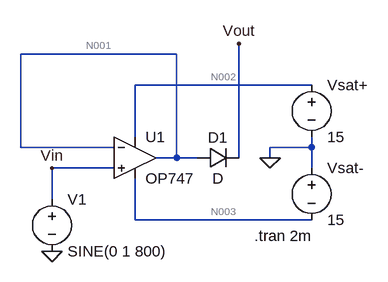
[diagram p0: schematic PRECISION_DIODE.asc]
PRECISION_DIODE.asc, the LTspice schematic file:
Version 4
SHEET 1 880 680
WIRE 448 0 208 0
WIRE 656 48 384 48
WIRE 384 128 384 48
WIRE 208 144 208 0
WIRE 352 144 208 144
WIRE 656 144 656 128
WIRE 656 144 592 144
WIRE 448 160 448 0
WIRE 448 160 416 160
WIRE 480 160 448 160
WIRE 544 160 544 -16
WIRE 592 160 592 144
WIRE 352 176 256 176
WIRE 656 176 656 144
WIRE 256 224 256 176
WIRE 384 256 384 192
WIRE 656 256 384 256
FLAG 592 160 0
FLAG 544 -16 Vout
FLAG 256 304 0
FLAG 256 176 Vin
SYMBOL OpAmps\\OP747 384 96 R0
SYMATTR InstName U1
SYMBOL voltage 656 32 R0
WINDOW 123 0 0 Left 0
WINDOW 39 0 0 Left 0
SYMATTR InstName Vsat+
SYMATTR Value 15
SYMBOL voltage 656 160 R0
WINDOW 123 0 0 Left 0
WINDOW 39 0 0 Left 0
SYMATTR InstName Vsat-
SYMATTR Value 15
SYMBOL voltage 256 208 R0
WINDOW 123 0 0 Left 0
WINDOW 39 0 0 Left 0
SYMATTR InstName V1
SYMATTR Value SINE(0 1 800)
SYMBOL diode 480 176 R270
WINDOW 0 32 32 VTop 2
WINDOW 3 0 32 VBottom 2
SYMATTR InstName D1
TEXT 568 280 Left 2 !.tran 2m

The netlist it stands for:
* PRECISION_DIODE.asc
XU1 Vin N001 N002 N003 N001 OP747  ; pins In+ In- V+ V- OUT
Vsat+ N002 0 15
Vsat- 0 N003 15
V1 Vin 0 SINE(0 1 800)
D1 N001 Vout D
.model D D
.lib standard.dio
.tran 2m
.backanno
.end

* Results of the author's LTspice run, read from the files saved beside the schematic
* Operating Point, zero values left out:
*   V(n001) = 80 µV
*   V(n003) = -15 V
*   V(n002) = 15 V
*   V(vout) = 80 µV
*   I(V1) = 10.86 nA
*   I(Vsat-) = -304.4 µA
*   I(Vsat+) = -304.4 µA
*   Ix(u1:1) = -10.86 nA
*   Ix(u1:2) = -8.856 nA
*   Ix(u1:99) = 304.4 µA
*   Ix(u1:50) = -304.4 µA
*   Ix(u1:45) = 8.856 nA
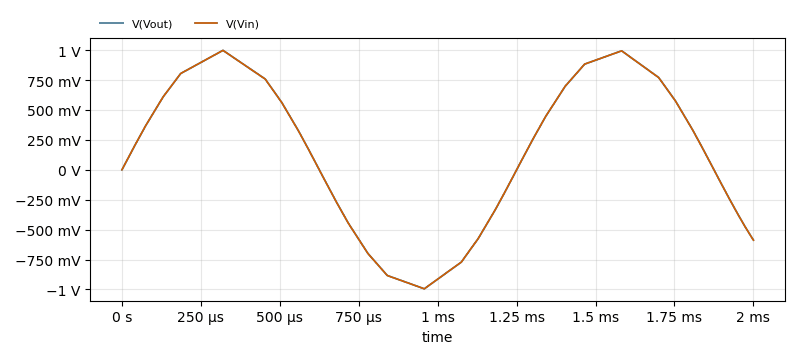
[diagram p1: Transient Analysis of PRECISION_DIODE.asc, plotted from the saved traces]
* Transient Analysis, 1 run:
*   V(Vout): min -994.2 mV, max 998.2 mV, average 174.9 mV, rms 677.9 mV, last -586.8 mV
*   V(Vin): min -994.2 mV, max 998.1 mV, average 174.8 mV, rms 678 mV, last -587.8 mV